# Altium project Beetech_NanoEvery v4.PrjPcb
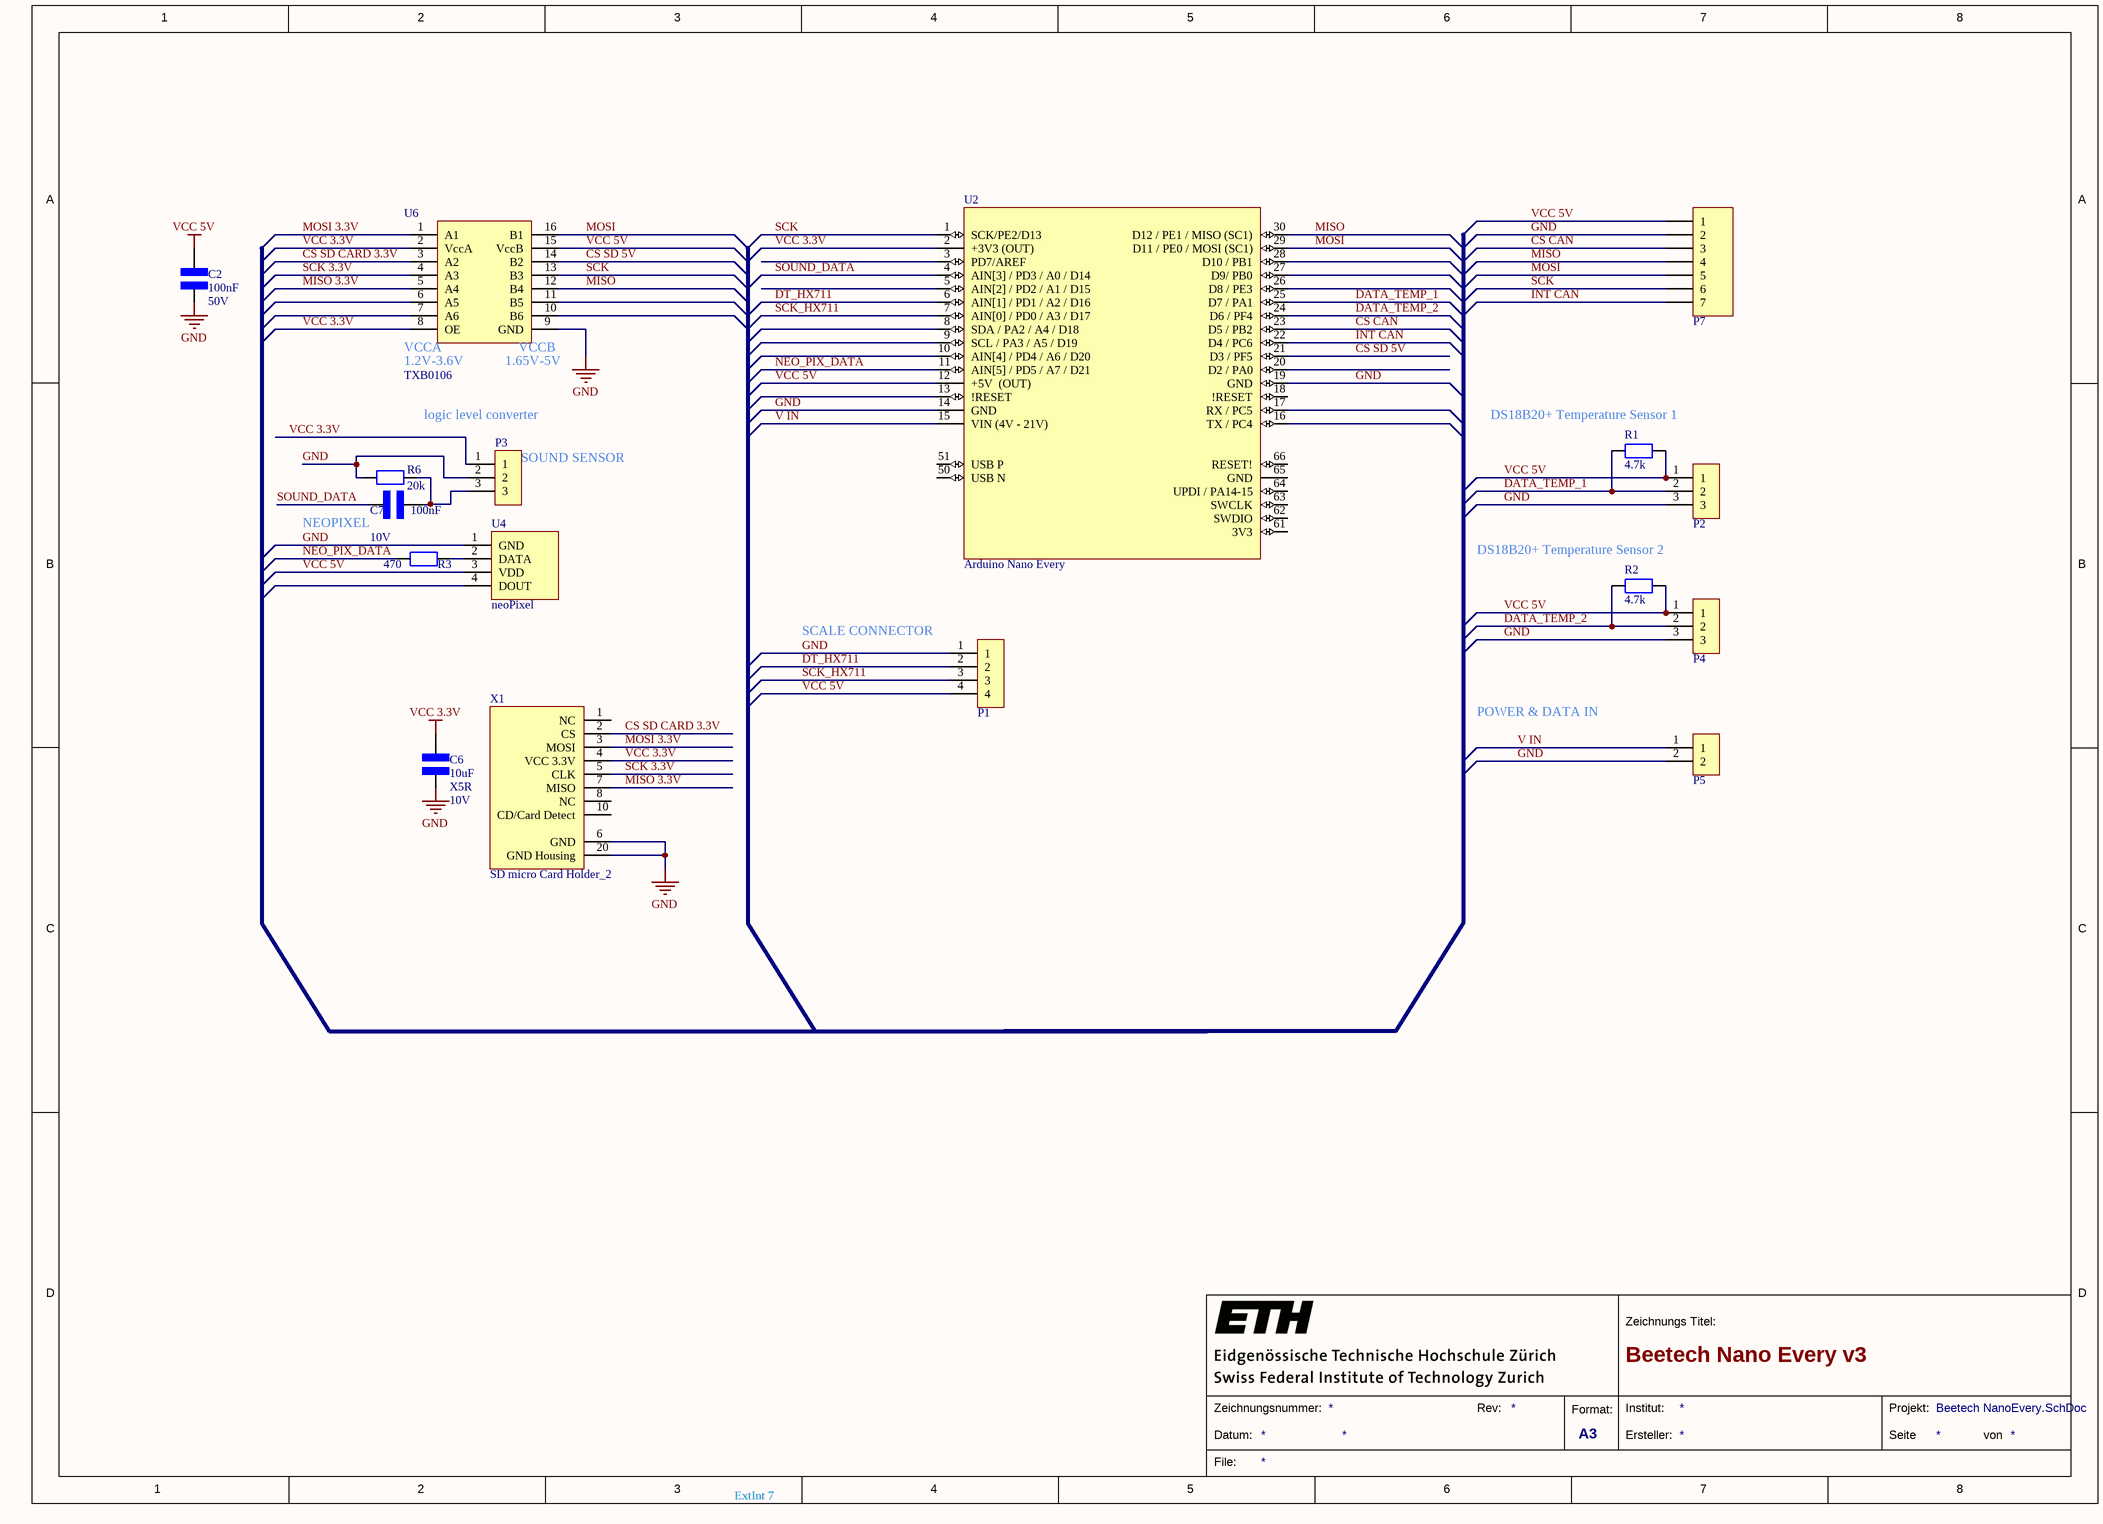
[diagram p0: Beetech NanoEvery.SchDoc]
1 sheet, 17 parts. Net scope: global (net labels, ports and power ports of the same name join across sheets).
Board file: Beetech NanoEvery.PcbDoc

## Sheet Beetech NanoEvery.SchDoc: Beetech Nano Every v3
size A3

### Parts
C2  value 100nF  Umax: 50V  [CAP 0603]  (hidden comment: 100nF 0603_1)
C6  value 10uF  Dielektrikum: X5R  Umax: 10V  [CAP 0603]  (hidden comment: 10uF 0603)
C7  value 100nF  Umax: 10V  [CAP 0603]  (hidden comment: 100nF 0603)
P1  4-Pin Right Angle Housing  [4PIN - RND 205-EK254-2.54-04P]  (value not drawn)
P2  3-Pin Right Angle Housing  [3PIN - RND 205-EK254-2.54-03P]  (value not drawn)
P3  3-Pin Right Angle Housing  [3PIN - RND 205-EK254-2.54-03P]  (value not drawn)
P4  3-Pin Right Angle Housing  [3PIN - RND 205-EK254-2.54-03P]  (value not drawn)
P5  2-Pin Right Angle Housing  [2PIN - RND 205-EK254-2.54-02P]  (value not drawn)
P7  8-Pin  [7PIN]  (value not drawn)
R1  value 4.7k  [RES 0603 FOOTPRINT]  (hidden comment: 4.7k Ohm 0603)
R2  value 4.7k  [RES 0603 FOOTPRINT]  (hidden comment: 4.7k Ohm 0603)
R3  value 470  [RES 0603 FOOTPRINT]  (hidden comment: 470 Ohm 0603)
R6  value 20k  [RES 0603 FOOTPRINT]  (hidden comment: 20k Ohm 0603)
U2  Arduino Nano Every  [Arduino Nano Every]
U4  neoPixel  [neoPixel 5050 adafruit 1655]
U6  TXB0106  [TSSOP-16L]
X1  SD micro Card Holder_2  [SD Card Holder - micro - 2 - sd Card inserted]

### Nets
GND: C2.1 C6.1 P1.1 P2.3 P3.2 P4.3 P5.2 P7.2 R6.1 U2.14(GND) U2.19(GND) U4.1(GND) U6.9(GND) X1.6(GND) X1.20(GND_Housing)
VCC 3.3V: C6.2 P3.1 U2.2(+3V3_(OUT)) U6.2(VccA) U6.8(OE) X1.4(VCC_3.3V)
VCC 5V: C2.2 P1.4 P2.1 P4.1 P7.1 R1.1 R2.1 U2.12(+5V__(OUT)) U4.3(VDD) U6.15(VccB)
CS CAN: P7.3 U2.23(D5_/_PB2)
CS SD 5V: U2.21(D3_/_PF5) U6.14(B2)
CS SD CARD 3.3V: U6.3(A2) X1.2(CS)
DATA_TEMP_1: P2.2 R1.2 U2.25(D7_/_PA1)
DATA_TEMP_2: P4.2 R2.2 U2.24(D6_/_PF4)
DT_HX711: P1.2 U2.6(AIN[1]_/_PD1_/_A2_/_D16)
INT CAN: P7.7 U2.22(D4_/_PC6)
MISO: P7.4 U2.30(D12_/_PE1_/_MISO_(SC1)) U6.12(B4)
MISO 3.3V: U6.5(A4) X1.7(MISO)
MOSI: P7.5 U2.29(D11_/_PE0_/_MOSI_(SC1)) U6.16(B1)
MOSI 3.3V: U6.1(A1) X1.3(MOSI)
NEO_PIX_DATA: R3.1 U2.11(AIN[5]_/_PD5_/_A7_/_D21)
SCK: P7.6 U2.1(SCK/PE2/D13) U6.13(B3)
SCK 3.3V: U6.4(A3) X1.5(CLK)
SCK_HX711: P1.3 U2.7(AIN[0]_/_PD0_/_A3_/_D17)
SOUND_DATA: C7.1 U2.4(AIN[3]_/_PD3_/_A0_/_D14)
V IN: P5.1 U2.15(VIN_(4V_-_21V))
NetC7_2: C7.2 P3.3 R6.2
NetR3_2: R3.2 U4.2(DATA)

Not connected (* = marked no-connect by the designer): U2 3(PD7/AREF) 5(AIN[2]_/_PD2_/_A1_/_D15) 8(SDA_/_PA2_/_A4_/_D18) 9(SCL_/_PA3_/_A5_/_D19) 10(AIN[4]_/_PD4_/_A6_/_D20) 13(!RESET) 16(TX_/_PC4) 17(RX_/_PC5) 18(!RESET) 20(D2_/_PA0) 26(D8_/_PE3) 27(D9/_PB0) 28(D10_/_PB1) 50(USB_N) 51(USB_P) 61(3V3) 62(SWDIO) 63(SWCLK) 64(UPDI_/_PA14-15) 65(GND) 66(RESET!); U4 4(DOUT); U6 6(A5) 7(A6) 10(B6) 11(B5); X1 1(NC) 8(NC) 10(CD/Card_Detect)

### Notes on the sheet
- logic level converter
- (near R1) DS18B20+ Temperature Sensor 1
- (near P3) SOUND SENSOR
- NEOPIXEL
- (near R2) DS18B20+ Temperature Sensor 2
- SCALE CONNECTOR
- POWER & DATA IN
- ExtInt 7
- 1
- 2
- 3
- 4
- 5
- 6
- 7
- 8
- A
- B
- C
- D
- Zeichnungs Titel:
- Datum:
- Zeichnungsnummer:
- Rev:
- Format:
- A3
- Ersteller:
- Institut:
- Seite
- Projekt:
- von
- File:
- (in symbol TXB0106 Level Converter) VCCA; VCCB; 1.2V-3.6V; 1.65V-5V

### Library data of the parts
C2 = 100nF 0603_1: C CERAMIC SMD; Bezeichnung: C SMD; Hersteller: Yageo; Hersteller Nr: CC0603JPX7R9BB104; Haendler: Mouser; Haendler Nr: 603-CC0603JPX79BB104; Preis (CHF): 0.15; housing/footprint: 0603
C6 = 10uF 0603: C CERAMIC SMD; Bezeichnung: C SMD; Hersteller: TDK; Hersteller Nr: C1608X5R1A106K080AC; Haendler: Mouser; Haendler Nr: 810-C1608X5R1A106K; Preis (CHF): 0.5; housing/footprint: 0603
C7 = 100nF 0603: C CERAMIC SMD; Bezeichnung: C SMD; Hersteller: Würth; Hersteller Nr: 885012206020; Haendler: Mouser; Haendler Nr: 710-885012206020; Preis (CHF): 0.05; housing/footprint: 0603
P1 = 4-Pin Screw Terminal: 4-Pin; Preis (CHF): 0.60; Haendler: Distrelec; Hersteller: RND; Hersteller Nr: RND 205-EK254-2.54-04P; Haendler Nr: 301-27-920; ComponentLink1Description: Mouser; ComponentLink1URL: https://www.mouser.ch/ProductDetail/TE-Connectivity/640453-2?qs=sGAEpiMZZMs%252bGHln7q6pm5E1Eb6qwPl2KIU5TYv3tVY%3d
P2-P4 = 3-Pin Screw Terminal: 3-Pin; Preis (CHF): 0.60; Haendler: Distrelec; Haendler Nr: 301-27-919; ComponentLink1Description: Mouser; ComponentLink1URL: https://www.mouser.ch/ProductDetail/TE-Connectivity/640453-2?qs=sGAEpiMZZMs%252bGHln7q6pm5E1Eb6qwPl2KIU5TYv3tVY%3d
P5 = 2-Pin Screw Terminal: 2-Pin; Preis (CHF): 0.60; Haendler: Distrelec; Haendler Nr: 301-27-918; ComponentLink1Description: Mouser; ComponentLink1URL: https://www.mouser.ch/ProductDetail/TE-Connectivity/640453-2?qs=sGAEpiMZZMs%252bGHln7q6pm5E1Eb6qwPl2KIU5TYv3tVY%3d
P7 = 7-Pin: LatestRevisionDate: 17-Jul-2002; LatestRevisionNote: Re-released for DXP Platform.; Publisher: Altium Limited
R1 R2 = 4.7k Ohm 0603: R SMD; Haendler: Mouser; Haendler Nr: 755-ESR03EZPF4701; Preis (CHF): 0.01; Bezeichnung: R SMD; housing/footprint: 0603
R3 = 470 Ohm 0603: R SMD; Preis (CHF): 0.15; Haendler: Mouser; HAendler Nr: 594-MCT06030C4700FP5; Bezeichnung: R SMD; housing/footprint: 0603
R6 = 20k Ohm 0603: R SMD; Haendler: Mouser; Haendler Nr: 71-CRCW060320K0FKEAC; Preis (CHF): 0.09; Bezeichnung: R SMD; housing/footprint: 0603
U2 = Arduino Nano Every: https://store.arduino.cc/nano-every-pack; Preis (CHF): 11.21; Haendler: Mouser; Haendler Nr: 782-ABX00028; Link: https://store.arduino.cc/nano-every-pack; ComponentLink3URL: http://ch.farnell.com/stmicroelectronics/stm32l496vgt6/mcu-arm-cortex-m4-80mhz-lqfp-100/dp/2725139?st=STM32L496VGT6; Link 2: https://www.mouser.ch/ProductDetail/Arduino/ABX00028?qs=PzGy0jfpSMtit6rnFl8mVg%3D%3D
U4 = neoPixel 5050 adafruit 1655: Preis (CHF): 0.60; Haendler Nr: 485-1655; Haendler: Mouser; Hersteller Nr: 1655; ComponentLink1Description: Mouser; ComponentLink1URL: https://www.mouser.ch/ProductDetail/TE-Connectivity/640453-2?qs=sGAEpiMZZMs%252bGHln7q6pm5E1Eb6qwPl2KIU5TYv3tVY%3d; Hersteller: Adafruit
U6 = TXB0106 Level Converter: Level Converter TXB0106; Hersteller: Texas Instruments; Haendler: Mouser; Haendler Nr: 595-TXB0106PWR; Preis (CHF): 1.45; Haendler2: Farnell; Haendler2 Nr: 1694679; Hersteller Nr: TXB0106; Link: http://ch.farnell.com/texas-instruments/txb0106pwr/txb-transceiver-tssop16/dp/1694679?ost=1694679&searchView=table&iscrfnonsku=false&ddkey=http%3Ade-CH%2FElement14_Switzerland%2Fsearch
X1 = SD micro Card Holder_2: SD micro Card  Holder; Hersteller Nr: 502774-0891; Hersteller: Molex; Haendler2 Nr: 2064063; Haendler2: Farnell; Preis (CHF): 3.15; Haendler: Mouser; Haendler Nr: 538-502774-0891